# Altium schematic sheet Power.SchDoc
size A
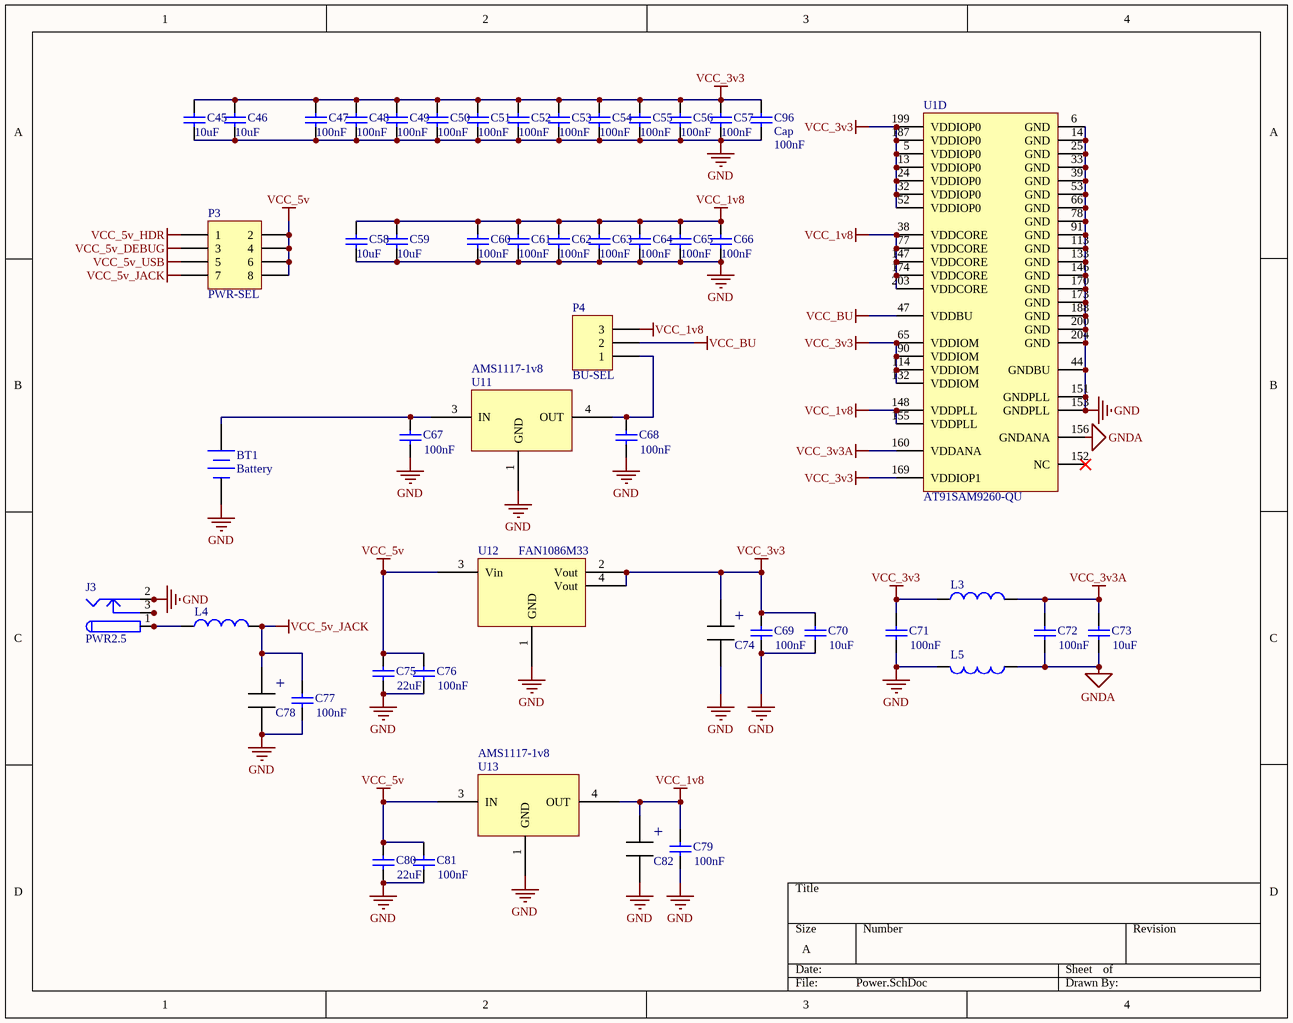
[diagram p0: Power.SchDoc]

## Parts
BT1  Battery  [BAT-2]
C45  value 10uF  [C0805]  (hidden comment: Cap)
C46  value 10uF  [C0805]  (hidden comment: Cap)
C47  value 100nF  [C0805]  (hidden comment: Cap)
C48  value 100nF  [C0805]  (hidden comment: Cap)
C49  value 100nF  [C0805]  (hidden comment: Cap)
C50  value 100nF  [C0805]  (hidden comment: Cap)
C51  value 100nF  [C0805]  (hidden comment: Cap)
C52  value 100nF  [C0805]  (hidden comment: Cap)
C53  value 100nF  [C0805]  (hidden comment: Cap)
C54  value 100nF  [C0805]  (hidden comment: Cap)
C55  value 100nF  [C0805]  (hidden comment: Cap)
C56  value 100nF  [C0805]  (hidden comment: Cap)
C57  value 100nF  [C0805]  (hidden comment: Cap)
C58  value 10uF  [C0805]  (hidden comment: Cap)
C59  value 10uF  [C0805]  (hidden comment: Cap)
C60  value 100nF  [C0805]  (hidden comment: Cap)
C61  value 100nF  [C0805]  (hidden comment: Cap)
C62  value 100nF  [C0805]  (hidden comment: Cap)
C63  value 100nF  [C0805]  (hidden comment: Cap)
C64  value 100nF  [C0805]  (hidden comment: Cap)
C65  value 100nF  [C0805]  (hidden comment: Cap)
C66  value 100nF  [C0805]  (hidden comment: Cap)
C67  value 100nF  [C0805]  (hidden comment: Cap)
C68  value 100nF  [C0805]  (hidden comment: Cap)
C69  value 100nF  [C0805]  (hidden comment: Cap)
C70  value 10uF  [C0805]  (hidden comment: Cap)
C71  value 100nF  [C0805]  (hidden comment: Cap)
C72  value 100nF  [C0805]  (hidden comment: Cap)
C73  value 10uF  [C0805]  (hidden comment: Cap)
C74  Capacitor  [Capacitor]  (value not drawn)
C75  value 22uF  [C1206]  (hidden comment: Cap)
C76  value 100nF  [C0805]  (hidden comment: Cap)
C77  value 100nF  [C1206]  (hidden comment: Cap)
C78  Capacitor  [Capacitor]  (value not drawn)
C79  value 100nF  [C0805]  (hidden comment: Cap)
C80  value 22uF  [C1206]  (hidden comment: Cap)
C81  value 100nF  [C0805]  (hidden comment: Cap)
C82  Capacitor  [Capacitor]  (value not drawn)
C96  Cap  value 100nF  [C0805]
J3  PWR2.5  [DC_jack]
L3  Ferrite Bead  [C0805]  (value not drawn)
L4  Ferrite Bead  [C1206]  (value not drawn)
L5  Inductor  [C0805]  (value not drawn)
P3  PWR-SEL  [HDR2X4]
P4  BU-SEL  [HDR1X3]
U1  AT91SAM9260-QU  [SQFP50P3122X3122X245-208N]  (part D of 4)
U11  AMS1117-1v8  [SOT223]
U12  FAN1086M33  [TO263]
U13  AMS1117-1v8  [LF33-TO-252]

## Nets
GND: BT1.2(-) C45.1 C46.1 C47.1 C48.1 C49.1 C50.1 C51.1 C52.1 C53.1 C54.1 C55.1 C56.1 C57.1 C58.1 C59.1 C60.1 C61.1 C62.1 C63.1 C64.1 C65.1 C66.1 C67.1 C68.1 C69.1 C70.1 C71.1 C74.1 C75.1 C76.1 C77.1 C78.1 C79.1 C80.1 C81.1 C82.1 C96.1 J3.2 J3.2A J3.2B L5.2 U1.6(GND) U1.14(GND) U1.25(GND) U1.33(GND) U1.39(GND) U1.44(GNDBU) U1.53(GND) U1.66(GND) U1.78(GND) U1.91(GND) U1.113(GND) U1.133(GND) U1.146(GND) U1.151(GNDPLL) U1.153(GNDPLL) U1.170(GND) U1.173(GND) U1.188(GND) U1.200(GND) U1.204(GND) U11.1(GND) U12.1(GND) U13.1(GND)
GNDA: C72.1 C73.1 L5.1 U1.156(GNDANA)
VCC_1v8: C58.2 C59.2 C60.2 C61.2 C62.2 C63.2 C64.2 C65.2 C66.2 C79.2 C82.2 P4.3 U1.38(VDDCORE) U1.77(VDDCORE) U1.147(VDDCORE) U1.148(VDDPLL) U1.155(VDDPLL) U1.174(VDDCORE) U1.203(VDDCORE) U13.4(OUT)
VCC_3v3: C45.2 C46.2 C47.2 C48.2 C49.2 C50.2 C51.2 C52.2 C53.2 C54.2 C55.2 C56.2 C57.2 C69.2 C70.2 C71.2 C74.2 C96.2 L3.1 U1.5(VDDIOP0) U1.13(VDDIOP0) U1.24(VDDIOP0) U1.32(VDDIOP0) U1.52(VDDIOP0) U1.65(VDDIOM) U1.90(VDDIOM) U1.114(VDDIOM) U1.132(VDDIOM) U1.169(VDDIOP1) U1.187(VDDIOP0) U1.199(VDDIOP0) U12.2(Vout) U12.4(Vout)
VCC_3v3A: C72.2 C73.2 L3.2 U1.160(VDDANA)
VCC_5v: C75.2 C76.2 C80.2 C81.2 P3.2 P3.4 P3.6 P3.8 U12.3(Vin) U13.3(IN)
VCC_5v_DEBUG: P3.3
VCC_5v_HDR: P3.1
VCC_5v_JACK: C77.2 C78.2 L4.2 P3.7
VCC_5v_USB: P3.5
VCC_BU: P4.2 U1.47(VDDBU)
NetBT1_1: BT1.1(+) C67.2 U11.3(IN)
NetC68_2: C68.2 P4.1 U11.4(OUT)
NetJ3_1: J3.1 J3.1A J3.1B L4.1
NetJ3_3: J3.3 J3.3A J3.3B

Not connected (* = marked no-connect by the designer): U1 152(NC)*

## Notes on the sheet
- (in symbol SMS capacitor) +

## Library data of the parts
BT1 = Battery: Multicell Battery; Published: 24-Mar-1999; LatestRevisionDate: 17-Jul-2002; LatestRevisionNote: Re-released for DXP Platform.; PackageReference: BAT-2; Publisher: Altium Limited; PackageDescription: Battery; 2 Leads
C45-C73 C75-C77 C79-C81 C96 = Cap: Capacitor; Published: 8-Jun-2000; LatestRevisionDate: 17-Jul-2002; LatestRevisionNote: Re-released for DXP Platform.; PackageReference: RAD-0.3; Publisher: Altium Limited; PackageDescription: Radial Cap, Thru-Hole; 2 Leads; 0.3 in Pin Spacing
C74 C78 C82 = SMS capacitor: Value: 47uf
J3 = PWR2.5: Low Voltage Power Supply Connector; Published: 17-Dec-2003; DatasheetDocument: 09-May-2002; Publisher: Altium Limited; ComponentLink1Description: Manufacturer Link; ComponentLink1URL: http://domino.kycon.com/internet/Products.html
L3-L5 = Inductor: Code_IEC: 1005; Value: 10mH; Published: 8-Jun-2000; LatestRevisionDate: 29-May-2009; LatestRevisionNote: IPC-7351 Footprint Added.; PackageReference: 0402-A; Publisher: Altium Limited; PackageDescription: Chip Inductor; Code_JEITA: 0402
P3 = Header 4X2: Header, 4-Pin, Dual row; LatestRevisionDate: 17-Jul-2002; LatestRevisionNote: Re-released for DXP Platform.; Publisher: Altium Limited
P4 = Header 3: Header, 3-Pin; LatestRevisionDate: 17-Jul-2002; LatestRevisionNote: Re-released for DXP Platform.; Publisher: Altium Limited
U1 = AT91SAM9260-QU: AT91 ARM Thumb 32-bit Embedded MPU, 210MHz, 32KB ROM, 2x4KB SRAM, EBI, E-MAC, FS USB, 208-Pin PQFP, Industrial Grade (-40°C to 85°C), Pb-Free; DatasheetVersion: revJ, May-2011; PackageVersion: Jul-2005; PackageReference: QFP208; PackageDescription: 208-Pin Plastic Shrink Quad Flat Pack 0.5 mm Pitch; Code_JEDEC: MS-022; ComponentLink1Description: Manufacturer URL; ComponentLink1URL: http://www.atmel.com/; ComponentLink2Description: AT91SAM9260 Datasheet; ComponentLink2URL: http://www.atmel.com/dyn/resources/prod_documents/doc6221.pdf; ComponentLink3Description: AT91SAM9260 Summary; ComponentLink3URL: http://www.atmel.com/dyn/resources/prod_documents/6221s.pdf; ComponentLink4Description: ARM9E-S Reference Manual; ComponentLink4URL: http://www.atmel.com/dyn/resources/prod_documents/doc6178.pdf